# Altium schematic sheet ADC.SchDoc
size A4; SheetNumber: 3; SheetTotal: 8
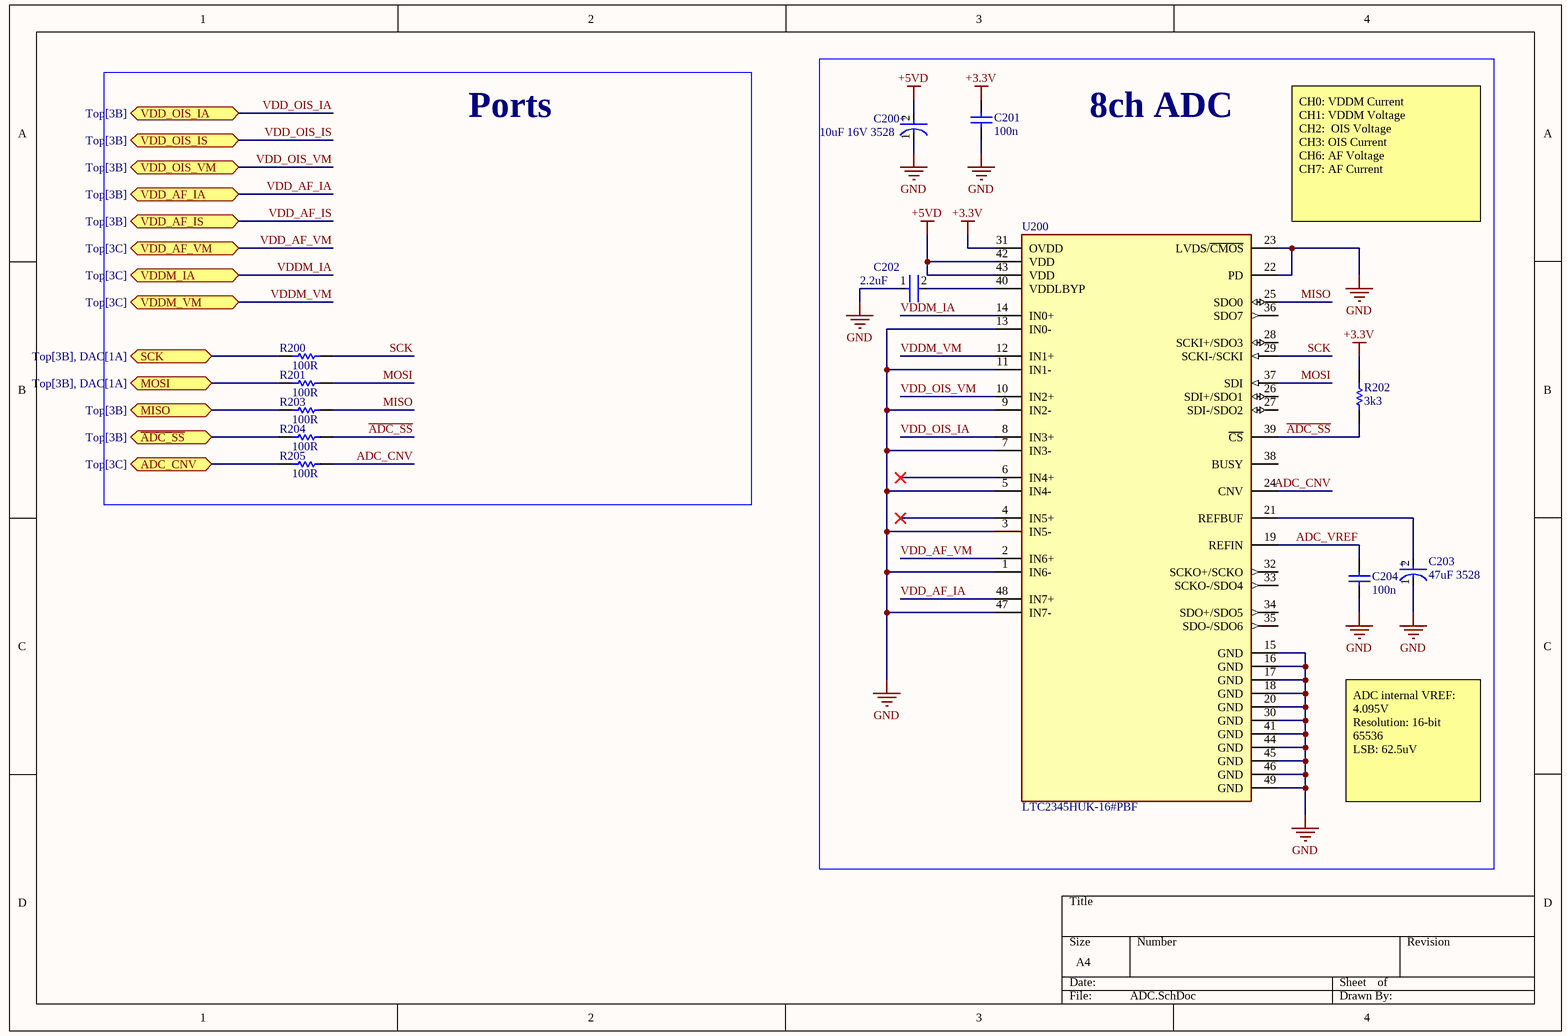
[diagram p0: ADC.SchDoc]

## Parts
C200  10uF 16V 3528  [FP-T491B106K020AT-MFG]
C201  100n  [SAMS-C0603-2_M]
C202  2.2uF  [FP-CL10-IPC_A]
C203  47uF 3528  [FP-TAJB-MFG]
C204  100n  [SAMS-C0603-2_M]
R200  100R  [RESC1608X55X30ML15T15]
R201  100R  [RESC1608X55X30ML15T15]
R202  3k3  [RESC1609X55X30ML15T15]
R203  100R  [RESC1608X55X30ML15T15]
R204  100R  [RESC1608X55X30ML15T15]
R205  100R  [RESC1608X55X30ML15T15]
U200  LTC2345HUK-16#PBF  [FP-UK-48-05-08-1704-MFG]

## Blocks framed on the sheet
Ports: R200 R201 R203-R205
8ch ADC: C200-C204 R202 U200

## Ports
ADC_CNV (bidir, see Top[3C]), MISO (bidir, see Top[3B]), MOSI (bidir, see Top[3B], DAC[1A]), SCK (bidir, see Top[3B], DAC[1A]), VDD_AF_IA (bidir, see Top[3B]), VDD_AF_IS (bidir, see Top[3B]), VDD_AF_VM (bidir, see Top[3C]), VDD_OIS_IA (bidir, see Top[3B]), VDD_OIS_IS (bidir, see Top[3B]), VDD_OIS_VM (bidir, see Top[3B]), VDDM_IA (bidir, see Top[3C]), VDDM_VM (bidir, see Top[3C]), ~{ADC_SS} (bidir, see Top[3B])

## Nets
+3.3V: C201.2 R202.1 U200.31(OVDD)
+5VD: C200.2(A) U200.42(VDD) U200.43(VDD)
GND: C200.1(C) C201.1 C202.1 C203.1(C) C204.1 U200.1(IN6-) U200.3(IN5-) U200.5(IN4-) U200.7(IN3-) U200.9(IN2-) U200.11(IN1-) U200.13(IN0-) U200.15(GND) U200.16(GND) U200.17(GND) U200.18(GND) U200.20(GND) U200.22(PD) U200.23(LVDS/~{CMOS}) U200.30(GND) U200.41(GND) U200.44(GND) U200.45(GND) U200.46(GND) U200.47(IN7-) U200.49(GND)
~{ADC_SS}: R202.2 R204.1 U200.39(~{CS})
~{ADC_SS}: R204.2 ; port ~{ADC_SS}  [a separate net that carries the same name]
ADC_CNV: R205.1 U200.24(CNV)
ADC_CNV: R205.2 ; port ADC_CNV  [a separate net that carries the same name]
ADC_VREF: C204.2 U200.19(REFIN)
MISO: R203.1 U200.25(SDO0)
MISO: R203.2 ; port MISO  [a separate net that carries the same name]
MOSI: R201.1 U200.37(SDI)
MOSI: R201.2 ; port MOSI  [a separate net that carries the same name]
SCK: R200.1 U200.29(SCKI-/SCKI)
SCK: R200.2 ; port SCK  [a separate net that carries the same name]
VDD_AF_IA: U200.48(IN7+) ; port VDD_AF_IA
VDD_AF_IS: port VDD_AF_IS
VDD_AF_VM: U200.2(IN6+) ; port VDD_AF_VM
VDD_OIS_IA: U200.8(IN3+) ; port VDD_OIS_IA
VDD_OIS_IS: port VDD_OIS_IS
VDD_OIS_VM: U200.10(IN2+) ; port VDD_OIS_VM
VDDM_IA: U200.14(IN0+) ; port VDDM_IA
VDDM_VM: U200.12(IN1+) ; port VDDM_VM
NetC202_2: C202.2 U200.40(VDDLBYP)
NetC203_2: C203.2(A) U200.21(REFBUF)

Not connected (* = marked no-connect by the designer): U200 4(IN5+)* 6(IN4+)* 26(SDI+/SDO1) 27(SDI-/SDO2) 28(SCKI+/SDO3) 32(SCKO+/SCKO) 33(SCKO-/SDO4) 34(SDO+/SDO5) 35(SDO-/SDO6) 36(SDO7) 38(BUSY)

## Notes on the sheet
- (near U200) CH0: VDDM Current
  CH1: VDDM Voltage
  CH2:  OIS Voltage
  CH3: OIS Current
  CH6: AF Voltage
  CH7: AF Current
- ADC internal VREF: 4.095V
  Resolution: 16-bit
  65536
  LSB: 62.5uV
- (in symbol CMP-2000-07191-2) +
- (in symbol CMP-04424-000629-1) +

## Library data of the parts
C200 = CMP-2000-07191-2: CAP TANT 10UF 10% 20V 1411; Polarity: Polar; Life (Hours): 2000Hour; Dissipation Factor: 6%; Leakage Current: 2uA; Dielectric Material: Tantalum; Ripple Current: 201mA; ESR (Equivalent Series Resistance): 2.1R; Weight: 0.002293oz; Max Operating Temperature: 125°C; Failure Rate: 0.001%; Tolerance: 10%; Case Code (Metric): 3528; Case Code (Imperial): 1411; Number of Pins: 2; Case/Package: 1411; Width: 2.8mm; Height: 1.9mm; Voltage Rating: 20V; Voltage: 20V; Lead Free: Lead Free; Features: General Purpose; Radiation Hardening: No; Min Operating Temperature: -55°C; Length: 3.5mm; Mount: Surface Mount; Depth: 2.8mm; Voltage Rating (DC): 20V; Termination: SMD/SMT; Package Quantity: 1; Capacitance: 10uF; Packaging: Tape and Reel; RoHS Compliant: Yes; REACH SVHC: No SVHC; Height - Seated (Max): 0.083inch
C201 C204 = CMP-2000-05332-1: Multi-layer Ceramic Capacitor, -55 to 125 degC, 2-Pin SMD (0603), RoHS, Tape and Reel; Manufacturer: Samsung Electro-Mechanics; Capacitance: 0.1µF; Rated Voltage: 50V; Dielectric: X7R; Tolerance (%): ±10%; Case Size/Dimension: 0603; Datasheet URL: https://datasheet.ciiva.com/29198/456651-da-01-en-vs-kondensator-0605-29198839.pdf; Manufacturer URL: http://www.samsungsem.com/global/index.jsp; Datasheet Version: Nov-10
C202 = CMP-13271-003582-1: Cap Ceramic 2.2uF 10V X7R ±10% Pad SMD 0603 +125°C T/R; Max Operating Temperature: 125°C; Package Quantity: 1; Thickness: 0.035inch; Capacitance: 2.2uF; Height: 0.8mm; Case/Package: 0603; Case Code (Metric): 1608; Radiation Hardening: No; Dielectric: X7R; Mount: Surface Mount; Contact Plating: Tin; Material: Ceramic; Length: 1.6mm; Packaging: Tape and Reel; Width: 0.031inch; Min Operating Temperature: -55°C; Case Code (Imperial): 0603; Depth: 0.8mm; Voltage Rating: 10V; Tolerance: 10%
C203 = CMP-04424-000629-1: 47uF 10V  ±10% 1Ω 1210  SMD Tantalum Capacitor; Leakage Current: 4.7uA; ESR (Equivalent Series Resistance): 1R; Dissipation Factor: 8%; Polarity: Polar; Package Quantity: 1; Length: 3.5mm; Dielectric Material: Tantalum; Series: TAJ; Termination: SMD/SMT; Case Code (Metric): 3528; Case Code (Imperial): 1210; Height - Seated (Max): 0.083inch; Lead Pitch: 1.4mm; Features: General Purpose; Radiation Hardening: No; Lead Free: Lead Free; Construction: Flat; RoHS Compliant: Yes; Case/Package: 1210; Min Operating Temperature: -55°C; Voltage: 10V; Depth: 2.8mm; Mount: Surface Mount; REACH SVHC: No SVHC; Width: 0.11inch; Voltage Rating (DC): 10V; Max Operating Temperature: 125°C; Capacitance: 47uF; Tolerance: 10%; Voltage Rating: 10V; Packaging: Tape and Reel; Number of Pins: 2; Height: 1.9mm
R200 R201 R203-R205 = CMP-2000-00179-1: Manufacturer: Panasonic; Part Number: ERJ-3EKF1000V
R202 = CMP-2000-00436-2: Chip Resistors, 3.3 KOhm, +/- 1%, 0.1 W, 0603 (1608 Metric), -55 to 155 degC, RoHS, Tape and Reel; Manufacturer: Panasonic; Max Power Dissipation: 100mW; Voltage Rating: 75V; Temperature Coefficient: 100ppm/degreesC; Datasheet Version: 42095.0; Width: 0.8mm; Mount: SurfaceMount; Radiation Hardening: No; Package URL: http://www.st.com/st-web-ui/static/active/en/resource/technical/document/datasheet/CD00001320.pdf; Depth: 0.8mm; Package Description: 2-Pin Surface Mount Device, Body 1.6 x 0.85 mm; Package Quantity: 1; Contact Plating: Tin; Length: 1.6mm; Max Operating Temperature: 155degC; RoHSCompliant: true; Datasheet URL: https://industrial.panasonic.com/cdbs/www-data/pdf/RDA0000/AOA0000C283.pdf; Height: 0.022inch; Military Standard: Not; Termination: SMD/SMT; Case Code (Metric): 1608; Composition: ThickFilm; Resistance: 3.3KOhm; Packaging: TapeandReel; Min Operating Temperature: -55degC; Case/Package: 0603; Voltage Rating (DC): 75V; Lead Free: LeadFree; Package Reference: 0603; Power Rating: 100mW; Manufacturer URL: http://www.panasonic.com/; Case Code (Imperial): 0603; REACH SVHC: NoSVHC; Number of Terminations: 2; Number of Pins: 2; Tolerance: 1%
U200 = CMP-09081-000619-1: IC ADC 16BIT SAR 48QFN; Number of Bits: 16; Resolution: 16b; Input Type: DIFFERENTIAL; Max Supply Voltage: 5.25V; Interface: SPI; Min Supply Voltage: 4.75V; Sampling Rate: 200000S/s; Number of Inputs: 8; Number of A/D Converters: 1; Max Operating Temperature: 125°C; Series: SoftSpan™; Case/Package: QFN; Min Operating Temperature: -40°C; REACH SVHC: No SVHC; RoHS Compliant: Yes; Number of Pins: 48; Packaging: Rail/Tube